# EAGLE schematic Joystick Module B (EAGLE 9.0.0)
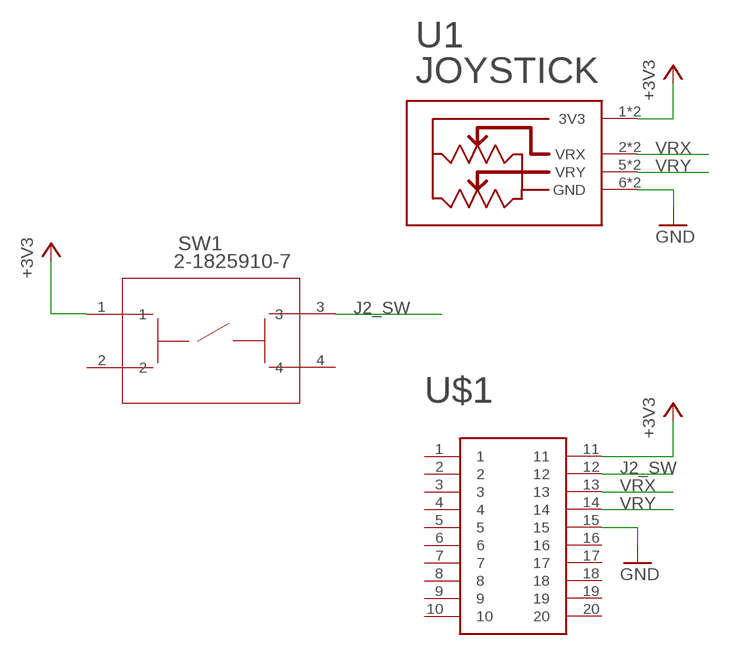
[diagram p0: schematic, sheet 1]

## Parts
SW1  2-1825910-7  [SW4_1825910-G]
U1  27800-JOYSTICK  [27800-JOYSTICK]
U$1  EDGE_CONNECTOR_20POS_CONTACTS  [EDGE_CONNECTOR_20POS_CONTACTS]

## Nets
+3V3: SW1.1 U1.1(3V3) U1.3(3V3) U$1.11
GND: U1.6(GND) U1.8(GND) U$1.15
J2_SW: SW1.3 U$1.12
VRX: U1.2(VRX) U1.4(VRX) U$1.13
VRY: U1.5(VRY) U1.7(VRY) U$1.14
Unconnected: SW1.2 SW1.4 U$1.1 U$1.2 U$1.3 U$1.4 U$1.5 U$1.6 U$1.7 U$1.8 U$1.9 U$1.10 U$1.16 U$1.17 U$1.18 U$1.19 U$1.20

## Library data of the parts
SW1 = spst-tactile-switch:2-1825910-7; MANUFACTURER_PART_NUMBER: 218259107; VENDOR: TE Connectivity
U1 = thanics_robotics:27800-JOYSTICK
U$1 = thanics_robotics:EDGE_CONNECTOR_20POS_CONTACTS